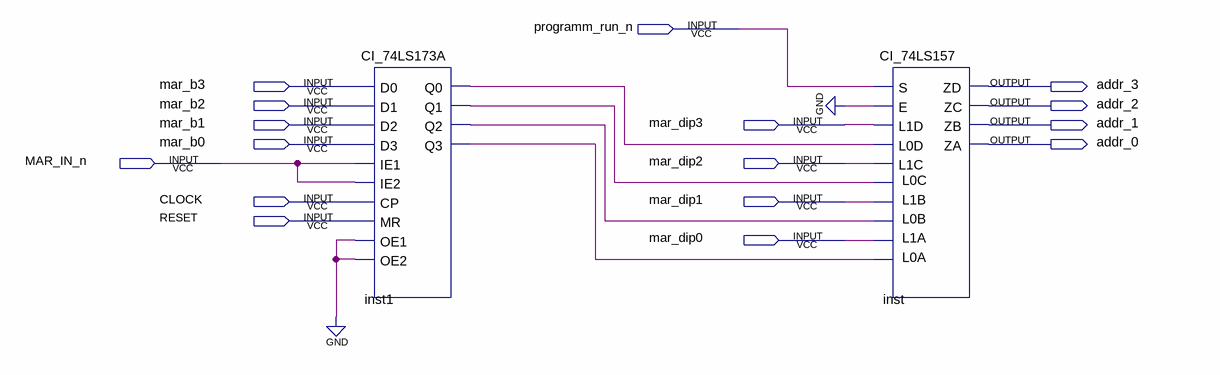
[diagram p0: schematic sheet]
// Quartus schematic REGISTRADOR_MAR.bdf as structural Verilog: 2 symbols, 16 pins
module REGISTRADOR_MAR (
  input  programm_run_n,
  input  mar_b3,
  input  mar_b2,
  input  mar_b1,
  input  mar_dip3,
  input  mar_b0,
  input  MAR_IN_n,
  input  mar_dip2,
  input  CLOCK,
  input  mar_dip1,
  input  RESET,
  input  mar_dip0,
  output addr_3,
  output addr_2,
  output addr_1,
  output addr_0
);

  wire inst1_q0, inst1_q1, inst1_q2, inst1_q3;

  CI_74LS173A inst1 (
    .D0(mar_b3), .D1(mar_b2), .D2(mar_b1), .D3(mar_b0), .IE1(MAR_IN_n), .IE2(MAR_IN_n), .CP(CLOCK),
    .MR(RESET), .OE1(1'b0), .OE2(1'b0), .Q2(inst1_q2), .Q1(inst1_q1), .Q3(inst1_q3), .Q0(inst1_q0));
  CI_74LS157 inst (
    .S(programm_run_n), .E(1'b0), .L1D(mar_dip3), .L0D(inst1_q0), .L0C(inst1_q1), .L1B(mar_dip1),
    .L0B(inst1_q2), .L1A(mar_dip0), .L0A(inst1_q3), .L1C(mar_dip2), .ZD(addr_3), .ZC(addr_2), .ZB(addr_1),
    .ZA(addr_0));
endmodule
